# EAGLE design WeatherShield_Air (EAGLE 7.3.0)
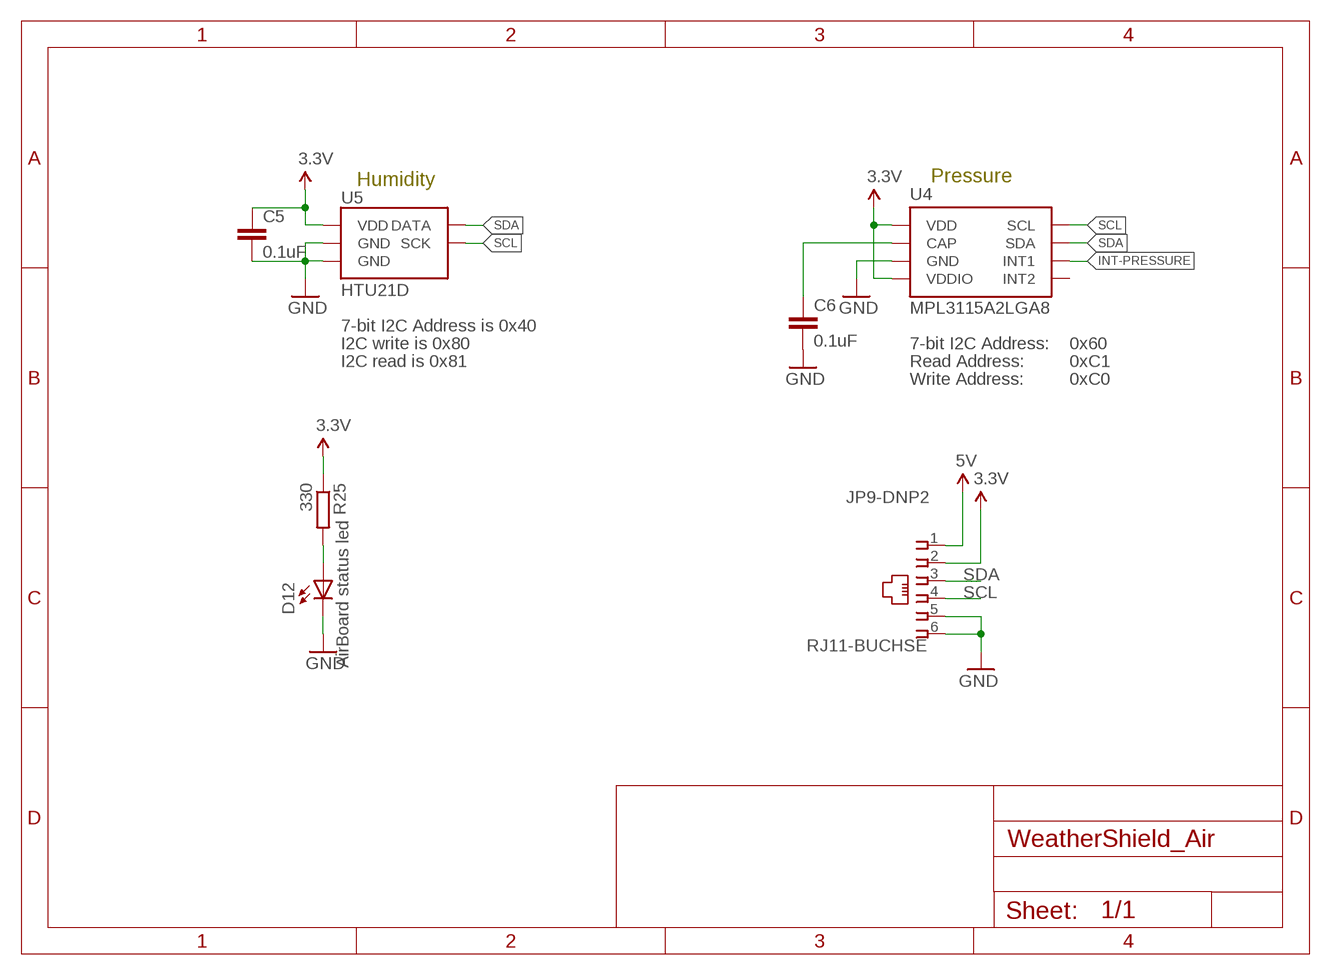
[diagram p0: schematic, sheet 1]

## Parts
C5  0.1uF  C-EUC0603  [C0603]
C6  0.1uF  C-EUC0603  [C0603]
D12  AirBoard status led  LED0603  [LED-0603]
JP9-DNP2  RJ11-BUCHSE  [RJ11-STECKER]
R25  330  R-EU_R0603  [R0603]
U4  MPL3115A2LGA8  [LGA8]
U5  HTU21D  HTU21DSMD  [HTU21D]

## Nets
3.3V: C5.1 JP9-DNP2.2 R25.1 U4.1(VDD) U4.4(VDDIO) U5.VDD
5V: JP9-DNP2.1
GND [vcc]: C5.2 C6.2 D12.C JP9-DNP2.5 JP9-DNP2.6 U4.3(GND) U5.7(GND) U5.GND
INT-PRESSURE: U4.6(INT1)
N$5: C6.1 U4.2(CAP)
N$28: D12.A R25.2
SCL: JP9-DNP2.4 U4.8(SCL) U5.SCK
SDA: JP9-DNP2.3 U4.7(SDA) U5.DATA
Unconnected: U4.5(INT2)

## Notes on the sheet
- Humidity | Pressure
- 7-bit I2C Address is 0x40
- I2C write is 0x80 | 7-bit I2C Address: | 0x60
- I2C read is 0x81 | Read Address: | 0xC1
- Write Address: | 0xC0

## Library data of the parts
C5 C6 = rcl:C-EU: CAPACITOR, European symbol
D12 = SparkFun:LED: LEDs Standard schematic elements and footprints for 5mm, 3mm, 1206, and 0603 sized LEDs. 5mm - Spark Fun Electronics SKU : COM-00529 (and others)
JP9-DNP2 = FSEWeatherShield:RJ11-BUCHSE
R25 = rcl:R-EU_: RESISTOR, European symbol
U4 = SparkFun-Sensors:MPL3115A2: Altimeter/Pressure Sensor, I2C, 1.95V-3.6V supply, 50 to 110kPa; PROD_ID: IC-10869
U5 = SparkFun-Sensors:HTU21D; PROD_ID: IC-11793

## Net classes
1 vcc: width 0.203 mm

## Board
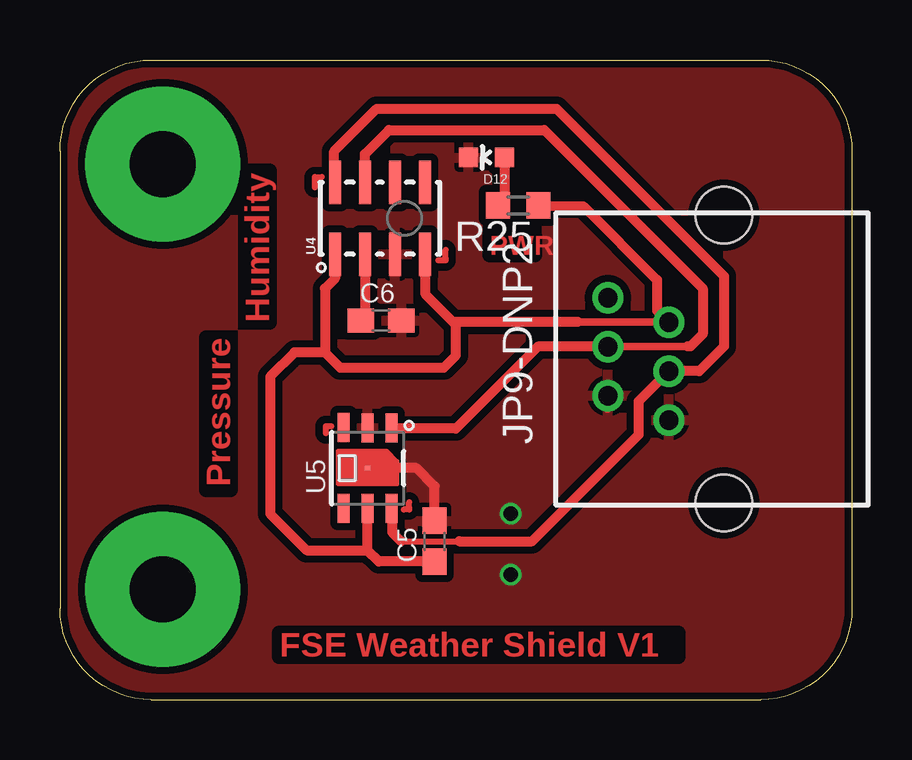
[diagram p1: board, top side]
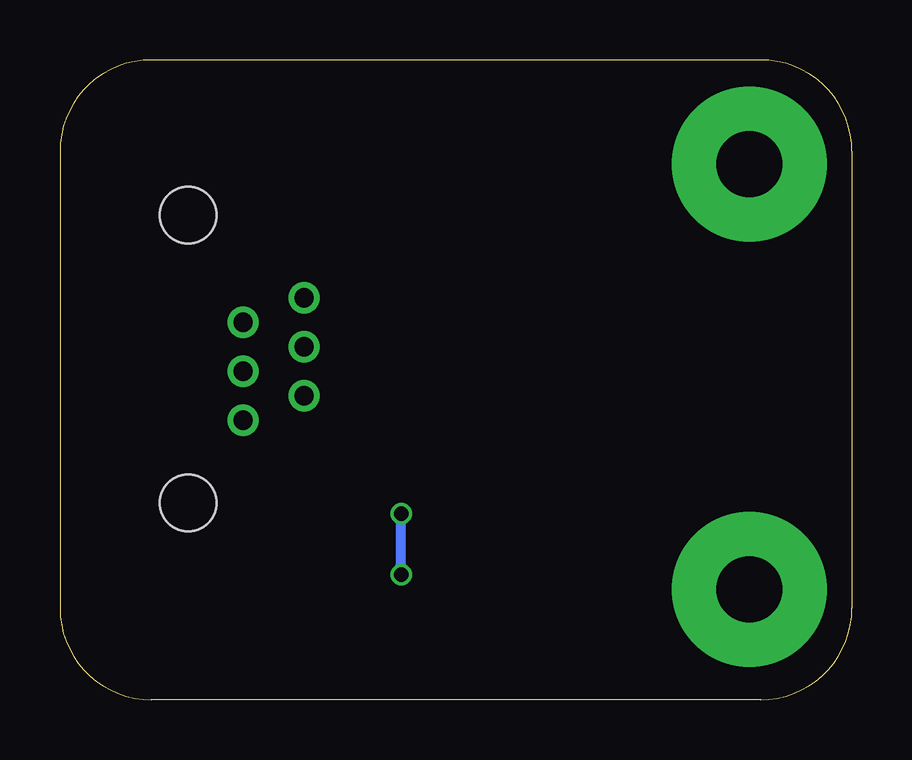
[diagram p2: board, bottom side, seen from below]

Size 33.02 x 26.67 mm. Coordinates in mm from the lower left corner, seen from the top.
Outline: 33.02,22.86 33.02,3.81 arc-90 29.21,0 3.81,0 arc-90 0,3.81 0,22.86 arc-90 3.81,26.67 29.21,26.67 arc-90 33.02,22.86
Copper layers (1*16): Top 0.018mm / dielectric 1.55mm / Bottom 0.018mm
Design rules "eC_2Layer_PClass6_BaseCopperO18_eCDefault": minimum track width 0.15mm, minimum drill 0.35mm, track to track 0.15mm, track to pad 0.15mm, pad to pad 0.15mm, via to via 0.15mm, smd to smd 0mil, copper to edge 0.25mm, drill to drill 0.35mm, minimum pad ring 0.175mm, minimum via ring 0.125mm, stop-mask expansion 0mil, vias tented up to drill 0.45mm, thermal gap 0.2mm

### Footprints (pad centres in the part's own frame; a part is rotated, then mirrored left to right if it is on the bottom)
C0603 = smd 1.1 x 1: 1 -0.85,0; 2 0.85,0
LED-0603 = smd 0.8 x 0.8: A 0,-0.75; C 0,0.75
RJ11-STECKER = drill 0.8 pad 1.3: 1 8.65,10.84; 2 7.63,8.3; 3 6.61,10.84; 4 5.59,8.3; 5 4.57,10.84; 6 3.55,8.3 | hole 2.36: 0.1,6; 12.1,6
R0603 = smd 1 x 1.1: 1 -0.85,0; 2 0.85,0
LGA8 = smd 1.8 x 0.5: 1 -1.5,1.875; 2 -1.5,0.625; 3 -1.5,-0.625; 4 -1.5,-1.875; 5 1.5,-1.875; 6 1.5,-0.625; 7 1.5,0.625; 8 1.5,1.875
HTU21D = smd 0.2 x 0.2: 7 0,0 | smd 1.2 x 0.5: DATA 1.68,-1; GND 1.68,0; NC@1 -1.68,1; NC@6 1.69,1; SCK -1.68,-1; VDD -1.68,0

### Placement (x,y rotation side)
C5  15.62,6.6 90 top
C6  13.39,15.8 0 top
D12  17.78,22.61 90 top
JP9-DNP2  33.68,8.1 90 top
R25  19.1,20.6 180 top
U4  13.34,20.07 90 top
U5  12.83,9.65 90 top

### Tracks (layer width: path | path; a pad name or v marks a point on that pad's centre or on a via)
3.3V
  Top 0.254: U4.4 15.24,18.57 15.24,18.54
  Top 0.305: JP9-DNP2.2 21.61,15.73 21.59,15.75
  Top 0.406: 21.59,15.75 16.64,15.75 | 16.64,15.75 16.38,15.75 15.24,16.89 15.24,18.54 | U4.1 11.46,17.56 11.05,17.14 11.05,14.48 | 16.64,15.75 16.51,15.62 16.51,14.35 16,13.84 11.68,13.84 11.05,14.48 | C5.1 13.3,5.75 12.83,6.22 | 12.83,6.22 U5.VDD | 11.05,14.48 9.78,14.48 8.76,13.46 8.76,7.75 10.29,6.22 12.83,6.22 | R25.1 21.82,20.57 24.89,17.5 24.89,16.22 JP9-DNP2.2
GND  (via drill 0.6)
  Top 0.406: JP9-DNP2.5 22.84,12.17 | 15.66,7.49 C5.2 15.62,8.89 14.86,9.65 U5.7
  Bottom 0.406: v18.8,5.21 v18.8,7.75
  pour Top (isolate 0.305): 0,26.8 33.27,26.54 33.27,-0.25 0,0
N$1  (via drill 2.75 pad 6.45)
  other vias: 4.29,22.33
N$2  (via drill 2.75 pad 6.45)
  other vias: 4.29,4.6
N$3
  Top 0.254: 10.64,21.72 10.62,21.72 10.62,21.36
N$4
  Top 0.254: 10.62,21.79 10.92,21.79
N$5
  Top 0.406: U4.2 12.71,15.97 C6.1
N$6
  Top 0.254: 16.05,18.39 16.08,18.39 16.08,18.74
N$7
  Top 0.254: 16.08,18.31 15.77,18.31
N$8
  Top 0.254: 14.53,8 14.55,8 14.55,8.23
N$9
  Top 0.254: 14.55,7.92 14.33,7.92
N$10
  Top 0.254: 11.1,11.33 11.07,11.33 11.07,11.1
N$11
  Top 0.254: 11.07,11.41 11.3,11.41
N$28
  Top 0.406: D12.A 18.53,20.88 R25.2
SCL
  Top 0.254: 14.22,6.6 16.64,6.6
  Top 0.406: 13.84,8.14 U5.SCK 13.85,8.13 13.85,6.98 14.22,6.6 | 16.64,6.6 19.68,6.6 24.13,11.05 24.13,12.44 JP9-DNP2.4 26.65,13.69 27.69,14.73 27.69,17.65 20.7,24.64 13.21,24.64 11.43,22.86 11.43,21.6 U4.8
SDA
  Top 0.305: 26.16,14.73 26.14,14.71 JP9-DNP2.3
  Top 0.406: JP9-DNP2.3 19.92,14.71 16.51,11.3 13.86,11.3 U5.DATA | U4.7 12.71,22.74 13.72,23.75 20.19,23.75 26.8,17.14 26.8,15.24 26.29,14.73 26.16,14.73

### Text on the board
Top: PWR | Humidity | Pressure | FSE Weather Shield V1
tValues: N. Seidle